# Altium schematic sheet Temperature_Sensor.SchDoc
size A4; SheetNumber: 1; SheetTotal: 5
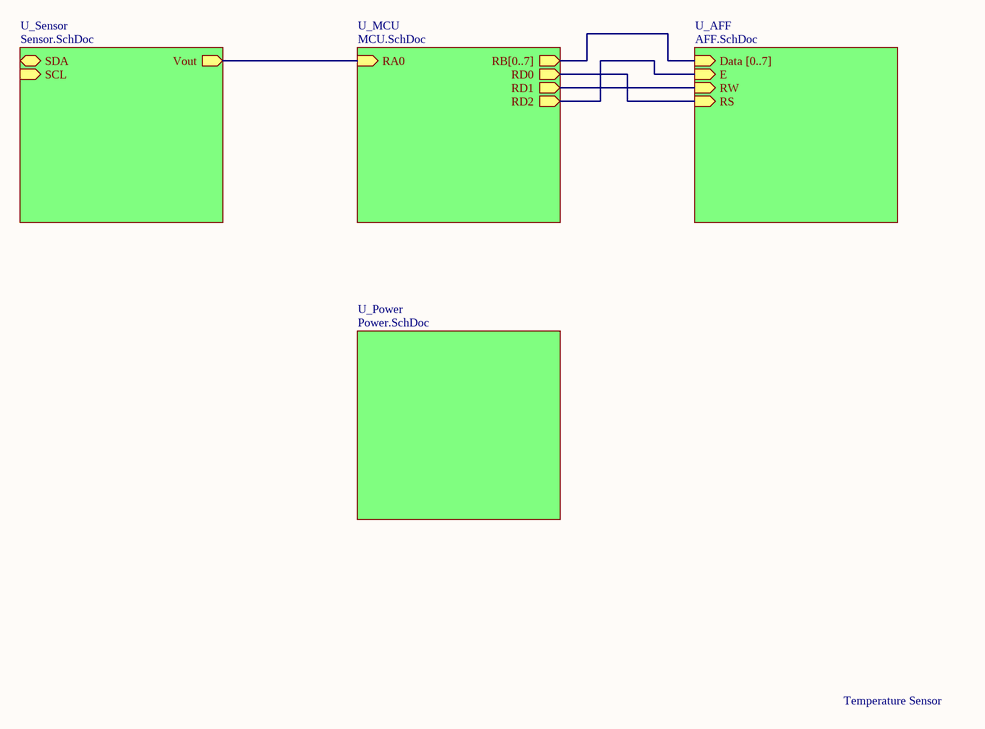
[diagram p0: Temperature_Sensor.SchDoc]

## Sub-sheets
U_AFF = AFF.SchDoc: Data [0..7] (in), E (in), RW (in), RS (in)
U_MCU = MCU.SchDoc: RB[0..7] (out), RA0 (in), RD0 (out), RD1 (out), RD2 (out)
U_Power = Power.SchDoc: no entries
U_Sensor = Sensor.SchDoc: Vout (out), SDA (bidir), SCL (in)

## Nets
(unnamed): sheet U_Sensor/Vout, sheet U_MCU/RA0
(unnamed): sheet U_AFF/E, sheet U_MCU/RD2
(unnamed): sheet U_AFF/RW, sheet U_MCU/RD1
(unnamed): sheet U_AFF/RS, sheet U_MCU/RD0

## Buses and harness runs
bus sheet U_AFF/Data [0..7] = sheet U_MCU/RB[0..7]

## Notes on the sheet
- Temperature Sensor